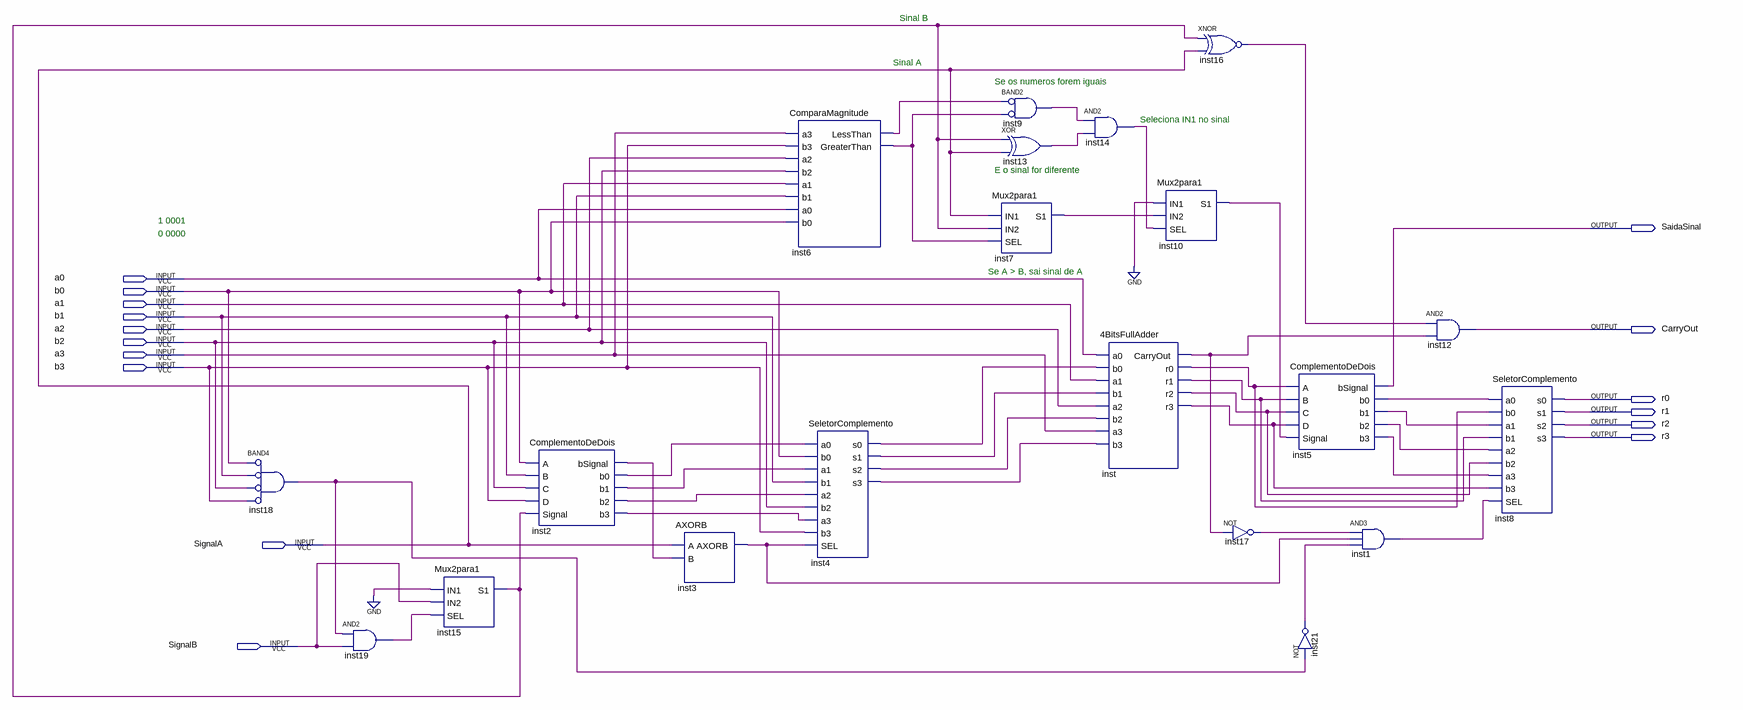
[diagram p0: schematic sheet]
// Quartus schematic AmaisB.bdf as structural Verilog: 20 symbols, 16 pins
module AmaisB (
  input  a0,
  input  b0,
  input  a1,
  input  b1,
  input  a2,
  input  b2,
  input  a3,
  input  b3,
  input  SignalA,
  input  SignalB,
  output SaidaSinal,
  output CarryOut,
  output r0,
  output r1,
  output r2,
  output r3
);

  wire inst1_out, inst2_b0, inst2_b1, inst2_b2, inst2_b3, inst2_bsignal, inst3_axorb, inst4_s0, inst4_s1,
       inst4_s2, inst4_s3, inst5_b0, inst5_b1, inst5_b2, inst5_b3, inst6_greaterthan, inst6_lessthan,
       inst7_s1, inst9_out, inst10_s1, inst13_out, inst14_out, inst15_s1, inst16_out, inst17_out, inst18_out,
       inst19_out, inst21_out, inst_carryout, inst_r0, inst_r1, inst_r2, inst_r3;

  and inst18 (inst18_out, ~b0, ~b1, ~b2, ~b3);  // BAND4
  and inst19 (inst19_out, inst18_out, SignalB);
  Mux2para1 inst15 (.IN1(1'b0), .IN2(SignalB), .SEL(inst19_out), .S1(inst15_s1));
  ComplementoDeDois inst2 (
    .A(b0), .B(b1), .C(b2), .D(b3), .Signal(inst15_s1), .bSignal(inst2_bsignal), .b0(inst2_b0),
    .b1(inst2_b1), .b2(inst2_b2), .b3(inst2_b3));
  AXORB inst3 (.A(SignalA), .B(inst2_bsignal), .AXORB(inst3_axorb));
  ComparaMagnitude inst6 (
    .a3(a3), .b3(b3), .a2(a2), .b2(b2), .a1(a1), .b1(b1), .a0(a0), .b0(b0), .LessThan(inst6_lessthan),
    .GreaterThan(inst6_greaterthan));
  SeletorComplemento inst4 (
    .a0(inst2_b0), .b0(b0), .a1(inst2_b1), .b1(b1), .a2(inst2_b2), .b2(b2), .a3(inst2_b3), .b3(b3),
    .SEL(inst3_axorb), .s0(inst4_s0), .s1(inst4_s1), .s2(inst4_s2), .s3(inst4_s3));
  and inst9 (inst9_out, ~inst6_lessthan, ~inst6_greaterthan);  // BAND2
  xor inst13 (inst13_out, inst15_s1, SignalA);
  Mux2para1 inst7 (.IN1(SignalA), .IN2(inst15_s1), .SEL(inst6_greaterthan), .S1(inst7_s1));
  and inst14 (inst14_out, inst9_out, inst13_out);
  \4BitsFullAdder  inst (
    .a0(a0), .b0(inst4_s0), .a1(a1), .b1(inst4_s1), .a2(a2), .b2(inst4_s2), .a3(a3), .b3(inst4_s3),
    .CarryOut(inst_carryout), .r0(inst_r0), .r1(inst_r1), .r2(inst_r2), .r3(inst_r3));
  Mux2para1 inst10 (.IN1(1'b0), .IN2(inst7_s1), .SEL(inst14_out), .S1(inst10_s1));
  xnor inst16 (inst16_out, inst15_s1, SignalA);
  not inst17 (inst17_out, inst_carryout);
  ComplementoDeDois inst5 (
    .A(inst_r0), .B(inst_r1), .C(inst_r2), .D(inst_r3), .Signal(inst10_s1), .bSignal(SaidaSinal),
    .b0(inst5_b0), .b1(inst5_b1), .b2(inst5_b2), .b3(inst5_b3));
  not inst21 (inst21_out, inst18_out);
  and inst1 (inst1_out, inst17_out, inst3_axorb, inst21_out);
  and inst12 (CarryOut, inst16_out, inst_carryout);
  SeletorComplemento inst8 (
    .a0(inst5_b0), .b0(inst_r0), .a1(inst5_b1), .b1(inst_r1), .a2(inst5_b2), .b2(inst_r2), .a3(inst5_b3),
    .b3(inst_r3), .SEL(inst1_out), .s0(r0), .s1(r1), .s2(r2), .s3(r3));

  // Notes on the sheet:
  //   Sinal B
  //   Sinal A
  //   Se os numeros forem iguais
  //   Seleciona IN1 no sinal
  //   E o sinal for diferente
  //   1 0001
  //   0 0000
  //   Se A > B, sai sinal de A
endmodule
